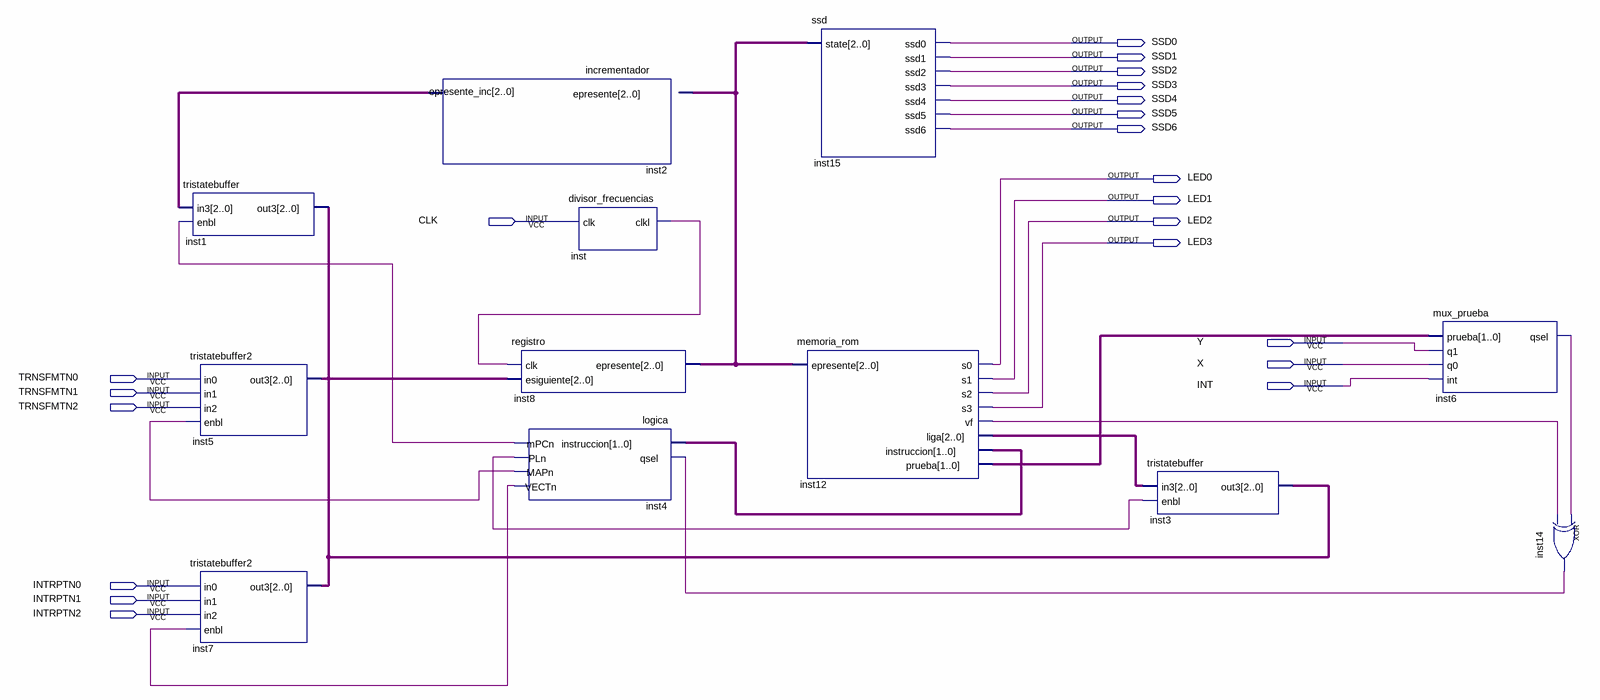
[diagram p0: schematic sheet]
// Quartus schematic Secuenciador.bdf as structural Verilog: 12 symbols, 21 pins
module Secuenciador (
  input  CLK,
  input  Y,
  input  X,
  input  TRNSFMTN0,
  input  INT,
  input  TRNSFMTN1,
  input  TRNSFMTN2,
  input  INTRPTN0,
  input  INTRPTN1,
  input  INTRPTN2,
  output SSD0,
  output SSD1,
  output SSD2,
  output SSD3,
  output SSD4,
  output SSD5,
  output SSD6,
  output LED0,
  output LED1,
  output LED2,
  output LED3
);

  wire inst4_mapn, inst4_mpcn, inst4_pln, inst4_vectn, inst6_qsel, inst12_vf, inst14_out, inst_clkl;
  wire [1:0] inst12_instruccion, inst12_prueba;
  wire [2:0] inst1_out3, inst2_epresente_inc, inst8_epresente, inst12_liga;

  tristatebuffer inst1 (.in3(inst2_epresente_inc), .enbl(inst4_mpcn), .out3(inst1_out3));
  tristatebuffer2 inst5 (.in0(TRNSFMTN0), .in1(TRNSFMTN1), .in2(TRNSFMTN2), .enbl(inst4_mapn), .out3(inst1_out3));
  tristatebuffer2 inst7 (.in0(INTRPTN0), .in1(INTRPTN1), .in2(INTRPTN2), .enbl(inst4_vectn), .out3(inst1_out3));
  incrementador inst2 (.epresente(inst8_epresente), .epresente_inc(inst2_epresente_inc));
  registro inst8 (.clk(inst_clkl), .esiguiente(inst1_out3), .epresente(inst8_epresente));
  logica inst4 (
    .instruccion(inst12_instruccion), .qsel(inst14_out), .mPCn(inst4_mpcn), .PLn(inst4_pln),
    .MAPn(inst4_mapn), .VECTn(inst4_vectn));
  divisor_frecuencias inst (.clk(CLK), .clkl(inst_clkl));
  ssd inst15 (
    .state(inst8_epresente), .ssd0(SSD0), .ssd1(SSD1), .ssd2(SSD2), .ssd3(SSD3), .ssd4(SSD4), .ssd5(SSD5),
    .ssd6(SSD6));
  memoria_rom inst12 (
    .epresente(inst8_epresente), .s0(LED0), .s1(LED1), .s2(LED2), .s3(LED3), .vf(inst12_vf),
    .liga(inst12_liga), .instruccion(inst12_instruccion), .prueba(inst12_prueba));
  tristatebuffer inst3 (.in3(inst12_liga), .enbl(inst4_pln), .out3(inst1_out3));
  mux_prueba inst6 (.prueba(inst12_prueba), .q1(Y), .q0(X), .\int (INT), .qsel(inst6_qsel));
  xor inst14 (inst14_out, inst6_qsel, inst12_vf);
endmodule
